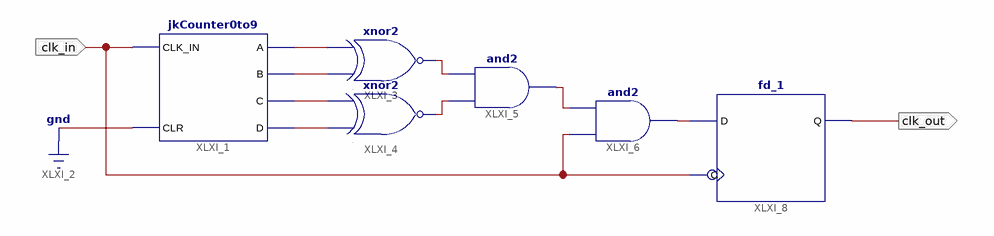
[diagram p0: schematic sheet 1]
// Xilinx ISE schematic clkDiv10.sch (spartan6) as structural Verilog: 6 symbols, 2 ports
module clkDiv10 (
  input  clk_in,
  output clk_out
);

  wire XLXN_5, XLXN_6, XLXN_7, XLXN_8, XLXN_9, XLXN_10, XLXN_13, XLXN_16;

  jkCounter0to9 XLXI_1 (.CLK_IN(clk_in), .A(XLXN_5), .B(XLXN_6), .C(XLXN_7), .D(XLXN_8), .CLR(1'b0));
  xnor XLXI_3 (XLXN_9, XLXN_6, XLXN_5);
  xnor XLXI_4 (XLXN_10, XLXN_8, XLXN_7);
  and XLXI_5 (XLXN_13, XLXN_10, XLXN_9);
  and XLXI_6 (XLXN_16, clk_in, XLXN_13);
  fd_1 XLXI_8 (.C(clk_in), .D(XLXN_16), .Q(clk_out));
endmodule
